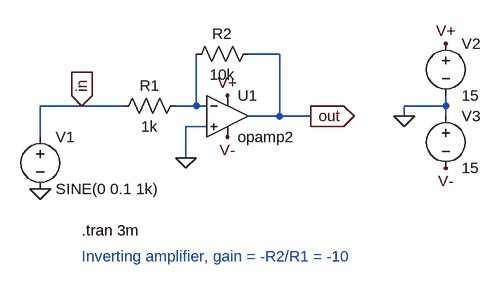
[diagram p0: schematic inverting_opamp.asc]
inverting_opamp.asc, the LTspice schematic file:
Version 4
SHEET 1 880 680
WIRE 32 208 160 208
WIRE 32 256 32 208
WIRE 240 208 288 208
WIRE 272 208 272 128
WIRE 352 128 400 128
WIRE 400 128 400 224
WIRE 352 224 400 224
WIRE 400 224 448 224
WIRE 288 240 256 240
WIRE 256 240 256 288
WIRE 656 192 656 224
WIRE 656 208 592 208
WIRE 592 208 592 224
FLAG 32 336 0
FLAG 96 208 in
IOPIN 96 208 In
FLAG 256 288 0
FLAG 320 192 V+
FLAG 320 256 V-
FLAG 448 224 out
IOPIN 448 224 Out
FLAG 656 112 V+
FLAG 592 224 0
FLAG 656 304 V-
SYMBOL voltage 32 240 R0
WINDOW 123 0 0 Left 0
WINDOW 39 0 0 Left 0
SYMATTR InstName V1
SYMATTR Value SINE(0 0.1 1k)
SYMBOL res 256 192 R90
WINDOW 0 0 56 VBottom 2
WINDOW 3 32 56 VTop 2
SYMATTR InstName R1
SYMATTR Value 1k
SYMBOL res 368 112 R90
WINDOW 0 0 56 VBottom 2
WINDOW 3 32 56 VTop 2
SYMATTR InstName R2
SYMATTR Value 10k
SYMBOL OpAmps\opamp2 320 160 R0
SYMATTR InstName U1
SYMBOL voltage 656 96 R0
SYMATTR InstName V2
SYMATTR Value 15
SYMBOL voltage 656 208 R0
SYMATTR InstName V3
SYMATTR Value 15
TEXT 96 400 Left 2 !.tran 3m
TEXT 96 440 Left 2 ;Inverting amplifier, gain = -R2/R1 = -10

The netlist it stands for:
* inverting_opamp.asc
V1 in 0 SINE(0 0.1 1k)
R1 N001 in 1k
R2 out N001 10k
XU1 0 N001 V+ V- out opamp2  ; pins In+ In- V+ V- OUT
V2 V+ 0 15
V3 0 V- 15
.tran 3m
* Inverting amplifier, gain = -R2/R1 = -10
.backanno
.end